# Altium schematic sheet Sum-Comp.SchDoc
size A
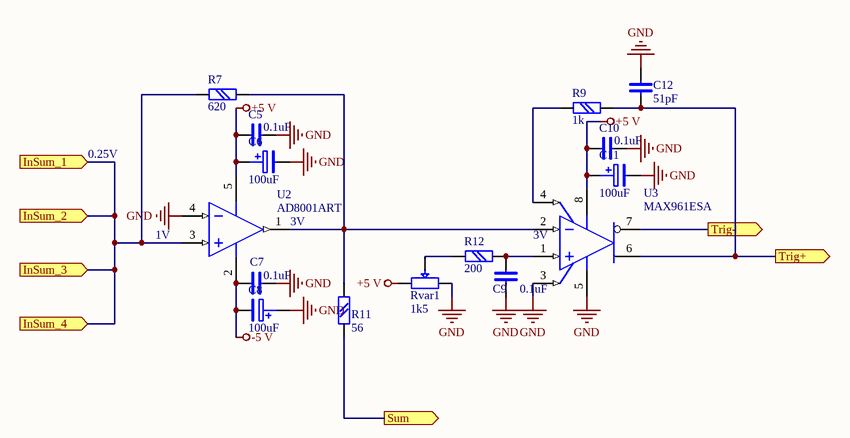
[diagram p0: Sum-Comp.SchDoc]

## Parts
C5  0.1uF  [chip0805]
C6  100uF  [CEL-SMD300]
C7  0.1uF  [chip0805]
C8  100uF  [CEL-SMD300]
C9  0.1uF  [chip0805]
C10  0.1uF  [chip0805]
C11  100uF  [CEL-SMD300]
C12  51pF  [chip0805]
R7  620  [chip0805]
R9  1k  [chip0805]
R11  56  [chip0805]
R12  200  [chip0805]
Rvar1  1k5  [RVAR1]
U2  AD8001ART  [RT-5]
U3  MAX961ESA  [NSO8_N]

## Ports
InSum_1 (in), InSum_2 (in), InSum_3 (in), InSum_4 (in), Sum (out), Trig+ (out), Trig- (out)

## Nets
+5 V: C5.2 C6.+ C10.2 C11.+ Rvar1.1 U2.5(V+) U3.8(V+)
-5 V: C7.2 C8.- U2.2(V-)
GND: C5.1 C6.- C7.1 C8.+ C9.1 C10.1 C11.- C12.1 Rvar1.3 U2.4(IN-) U3.3(SHDN) U3.5(GND)
InSum_1: R7.1 U2.3(IN+) ; port InSum_1, port InSum_2, port InSum_3, port InSum_4
Sum: R11.1 ; port Sum
Trig+: C12.2 R9.2 U3.6(Q) ; port Trig+
Trig-: U3.7(~{Q}) ; port Trig-
NetC9_2: C9.2 R12.2 U3.1(IN+)
NetR7_2: R7.2 R11.2 U2.1(OUT) U3.2(IN-)
NetR9_1: R9.1 U3.4(LE)
NetR12_1: R12.1 Rvar1.2

## Notes on the sheet
- 0.25V
- (near U2) 1V
- (near U2) 3V
- (near U3) 3V

## Library data of the parts
C5 C7 C9 C10 C12 = C: Text Field1: 20; Text Field2: 10
C6 C8 C11 = C POL: Text Field1: 20; Text Field2: 20
R7 R9 R11 R12 = R: Text Field1: 20; Text Field2: 20
Rvar1 = R VAR: Text Field1: 20; Text Field2: 20
U2 = AD8055ART: Low Cost, 300MHz Voltage Feedback Amplifier; Published: 8-Jun-2000; LatestRevisionDate: 17-Jul-2002; LatestRevisionNote: Re-released for DXP Platform.; DatasheetVersion: REV. 0 1997; PackageReference: RT-5; Publisher: Altium Limited; PackageDescription: SOT-23/SC-74A; 5 Leads; Body 3.1 x 3 mm, inc. leads (LxW max); Code_JEDEC: MO-178AA; ComponentLink1Description: Manufacturer Link; ComponentLink1URL: http://www.analog.com/en/prod/0,,759_786_AD8055%2C00.html; ComponentLink2Description: Datasheet; ComponentLink2URL: http://www.analog.com/UploadedFiles/Data_Sheets/40402558757264AD8055_6_i.pdf
U3 = MAX961ESA: Single Ultra-High-Speed, +3V/+5V, Beyond-the-Rails Comparator; Published: 16-Jan-2001; LatestRevisionDate: 13-Apr-2006; LatestRevisionNote: IPC-7351 Footprint Added.; DatasheetVersion: Jan-1998; PackageReference: NSO8; Publisher: Altium Limited; PackageDescription: 8-Pin Small Outline Integrated Circuit 1.27 mm Pitch; Code_JEDEC: MS-012-AA; Code_IPC: SOIC127P600-8; ComponentLink1Description: Manufacturer Link; ComponentLink1URL: http://www.maxim-ic.com/; ComponentLink2Description: Datasheet; ComponentLink2URL: http://pdfserv.maxim-ic.com/en/ds/MAX961-MAX999.pdf